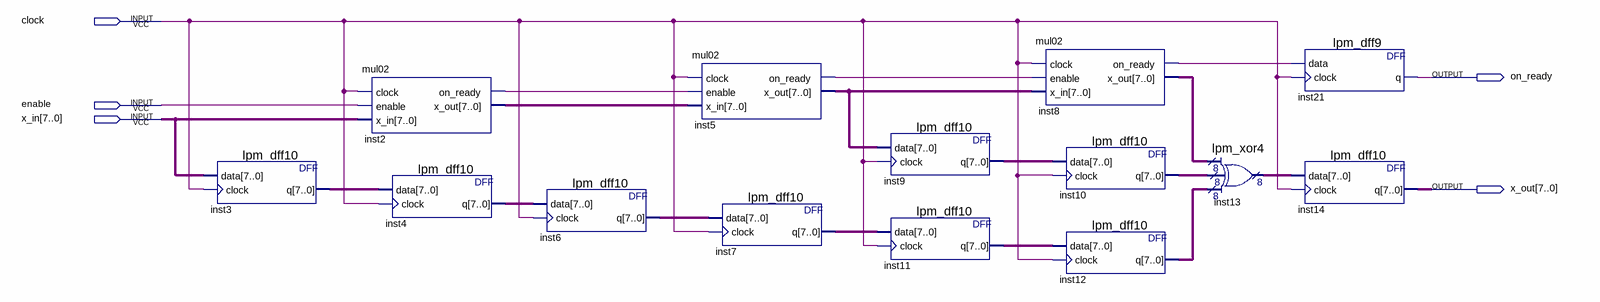
[diagram p0: schematic sheet]
// Quartus schematic mul0d.bdf as structural Verilog: 14 symbols, 5 pins
module mul0d (
  input  clock,
  input  enable,
  input  [7:0] x_in,
  output on_ready,
  output [7:0] x_out
);

  wire inst2_on_ready, inst5_on_ready, inst8_on_ready;
  wire [7:0] inst2_x_out, inst3_q, inst4_q, inst5_x_out, inst6_q, inst7_q, inst8_x_out, inst9_q, inst10_q,
       inst11_q, inst12_q, inst13_result;

  lpm_dff10 inst3 (.data(x_in), .clock(clock), .q(inst3_q));
  mul02 inst2 (.clock(clock), .enable(enable), .x_in(x_in), .on_ready(inst2_on_ready), .x_out(inst2_x_out));
  lpm_dff10 inst4 (.data(inst3_q), .clock(clock), .q(inst4_q));
  lpm_dff10 inst6 (.data(inst4_q), .clock(clock), .q(inst6_q));
  mul02 inst5 (
    .clock(clock), .enable(inst2_on_ready), .x_in(inst2_x_out), .on_ready(inst5_on_ready), .x_out(inst5_x_out));
  lpm_dff10 inst7 (.data(inst6_q), .clock(clock), .q(inst7_q));
  lpm_dff10 inst9 (.data(inst5_x_out), .clock(clock), .q(inst9_q));
  lpm_dff10 inst11 (.data(inst7_q), .clock(clock), .q(inst11_q));
  mul02 inst8 (
    .clock(clock), .enable(inst5_on_ready), .x_in(inst5_x_out), .on_ready(inst8_on_ready), .x_out(inst8_x_out));
  lpm_dff10 inst10 (.data(inst9_q), .clock(clock), .q(inst10_q));
  lpm_dff10 inst12 (.data(inst11_q), .clock(clock), .q(inst12_q));
  lpm_xor4 inst13 (.data0x(inst8_x_out), .data1x(inst10_q), .data2x(inst12_q), .result(inst13_result));
  lpm_dff9 inst21 (.data(inst8_on_ready), .clock(clock), .q(on_ready));
  lpm_dff10 inst14 (.data(inst13_result), .clock(clock), .q(x_out));
endmodule
